# EAGLE design board (EAGLE 9.6.2)
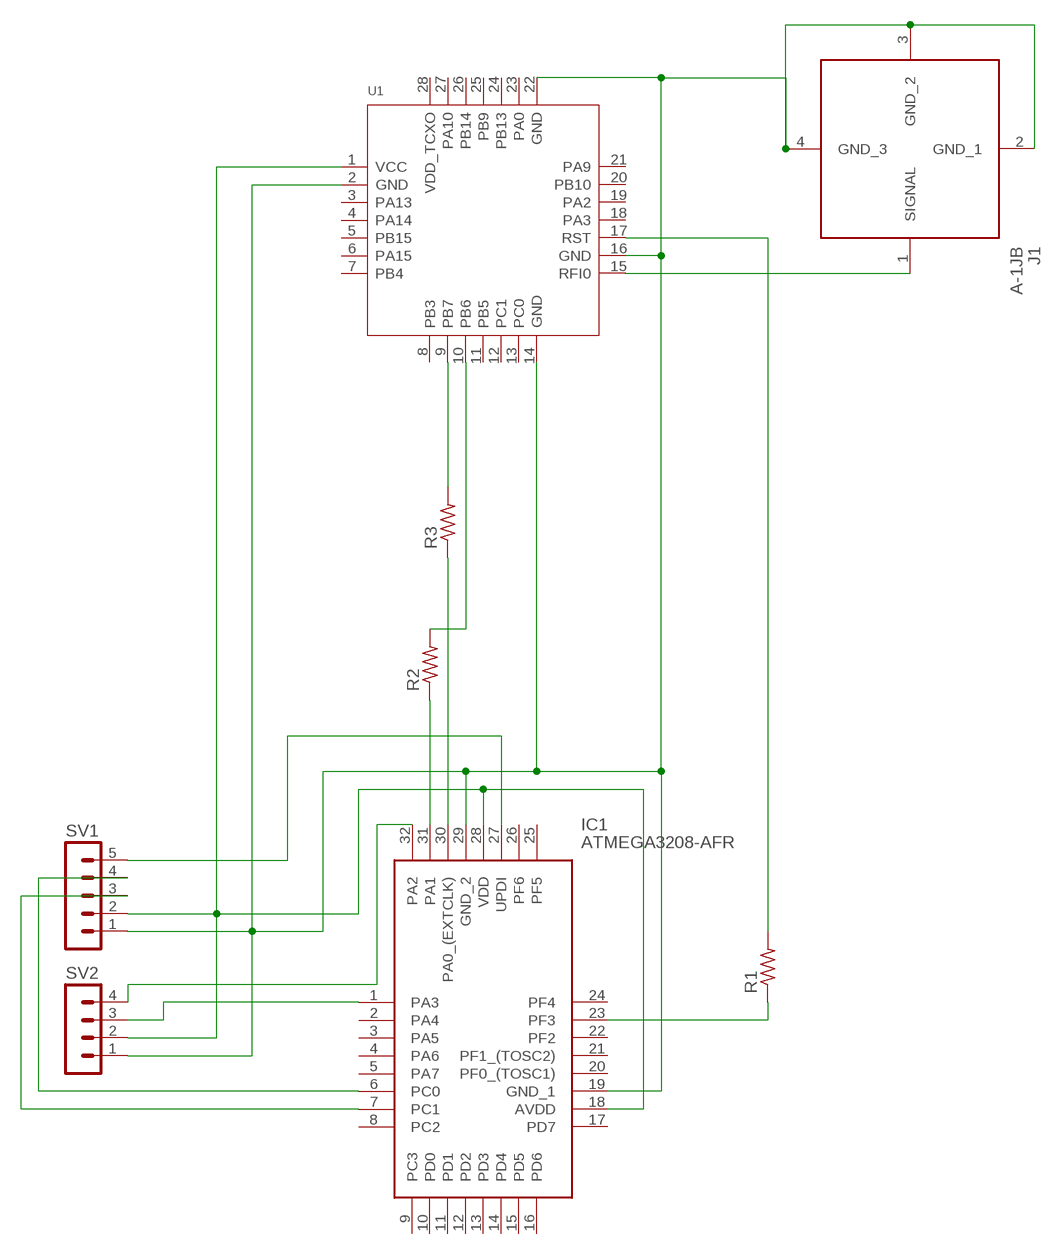
[diagram p0: schematic, sheet 1]

## Parts
IC1  ATMEGA3208-AFR  [QFP80P900X900X120-32N]
J1  A-1JB  [A1JB]
R1  22  CRCW08050000Z0EA  [RES_0805]
R2  22  CRCW08050000Z0EA  [RES_0805]
R3  22  CRCW08050000Z0EA  [RES_0805]
SV1  MA05-1  [MA05-1]
SV2  MA04-1  [MA04-1]
U1  MODULE_LORA_E5  [MODULE28P-1.25-12X12X2.5MM]

## Nets
N$1: IC1.19(GND_1) IC1.29(GND_2) J1.2(GND_1) J1.3(GND_2) J1.4(GND_3) SV1.1 SV2.1 U1.2(GND) U1.14(GND) U1.16(GND) U1.22(GND)
N$2: IC1.27(UPDI) SV1.5
N$3: IC1.18(AVDD) IC1.28(VDD) SV1.2 SV2.2 U1.1(VCC)
N$4: R1.2 U1.17(RST)
N$5: J1.1(SIGNAL) U1.15(RFI0)
N$6: R3.2 U1.9(PB7)
N$7: R2.2 U1.10(PB6)
N$8: IC1.23(PF3) R1.1
N$9: IC1.31(PA1) R2.1
N$10: IC1.30(PA0_(EXTCLK)) R3.1
N$11: IC1.32(PA2) SV2.4
N$12: IC1.1(PA3) SV2.3
N$13: IC1.6(PC0) SV1.4
N$14: IC1.7(PC1) SV1.3
Unconnected: IC1.2(PA4) IC1.3(PA5) IC1.4(PA6) IC1.5(PA7) IC1.8(PC2) IC1.9(PC3) IC1.10(PD0) IC1.11(PD1) IC1.12(PD2) IC1.13(PD3) IC1.14(PD4) IC1.15(PD5) IC1.16(PD6) IC1.17(PD7) IC1.20(PF0_(TOSC1)) IC1.21(PF1_(TOSC2)) IC1.22(PF2) IC1.24(PF4) IC1.25(PF5) IC1.26(PF6) U1.3(PA13) U1.4(PA14) U1.5(PB15) U1.6(PA15) U1.7(PB4) U1.8(PB3) U1.11(PB5) U1.12(PC1) U1.13(PC0) U1.18(PA3) U1.19(PA2) U1.20(PB10) U1.21(PA9) U1.23(PA0) U1.24(PB13) U1.25(PB9) U1.26(PB14) U1.27(PA10) U1.28(VDD_TCXO)

## Library data of the parts
IC1 = SamacSys_Parts:ATMEGA3208-AFR: 8-bit Microcontrollers - MCU 20MHz, 32KB, TQFP32, Ind 125C, Green, T&R Source: Datasheet; DESCRIPTION: 8-bit Microcontrollers - MCU 20MHz, 32KB, TQFP32, Ind 125C, Green, T&R; HEIGHT: 1.2mm; MANUFACTURER_NAME: Microchip; MANUFACTURER_PART_NUMBER: ATMEGA3208-AFR; MOUSER_PART_NUMBER: 579-ATMEGA3208AFR; MOUSER_PRICE-STOCK: https://www.mouser.co.uk/ProductDetail/Microchip-Technology-Atmel/ATMEGA3208-AFR?qs=y6ZabgHbY%252ByqMua8ssBYRQ%3D%3D
J1 = SamacSys_Parts:A-1JB: AMC Straight PCB Jack, Surface Mount Source: Datasheet <https://datasheet.datasheetarchive.com/originals/distributors/Datasheets-4/DSA-65271.pdf>; DESCRIPTION: AMC Straight PCB Jack, Surface Mount; HEIGHT: 1.05mm; MANUFACTURER_NAME: Amphenol; MANUFACTURER_PART_NUMBER: A-1JB; MOUSER_PART_NUMBER: 523-A-1JB; MOUSER_PRICE-STOCK: https://www.mouser.co.uk/ProductDetail/Amphenol-RF/A-1JB?qs=ncxkyCpAYDBidtvTkuzl1Q%3D%3D
R1-R3 = Resistor_Capacitor:CRCW08050000Z0EA: RES SMD 0 OHM JUMPER 1/8W 0805 Manufacturer's datasheet <http://www.vishay.com/docs/20035/dcrcwe3.pdf>; CREATED_BY: PCBLayout.com; DIGIKEY_PART_NUMBER: 541-0.0ATR-ND; MANUFACTURER: Vishay Dale; MPN: CRCW08050000Z0EA; PACKAGE: SMD 0805
SV1 = con-lstb:MA05-1: PIN HEADER; OC_FARNELL: unknown; OC_NEWARK: unknown
SV2 = con-lstb:MA04-1: PIN HEADER; OC_FARNELL: unknown; OC_NEWARK: unknown
U1 = LORA-E5_Eagle_Library (1):MODULE_LORA_E5

## Net classes
1 POWERLINES: width 0.254 mm

## Board
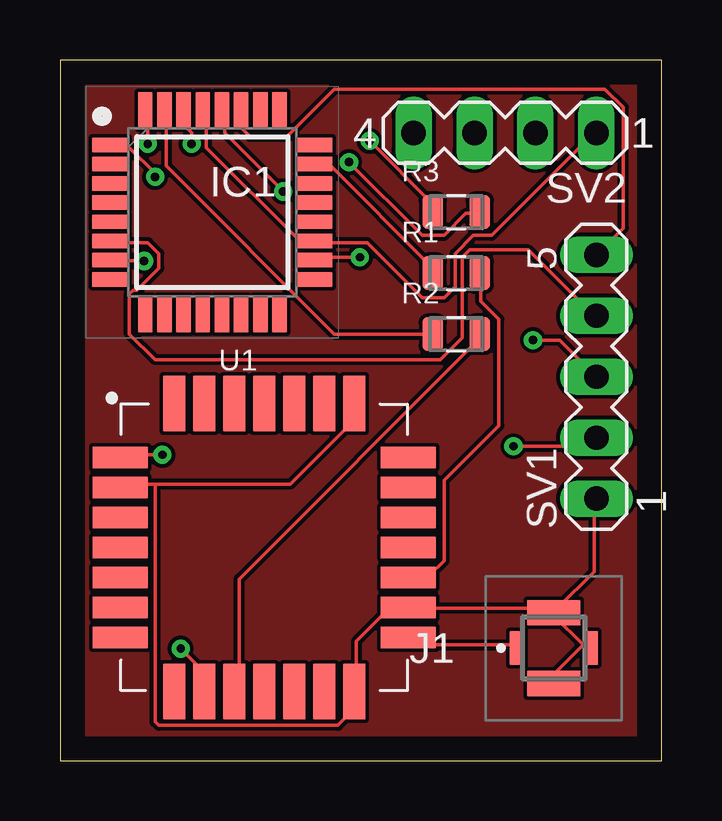
[diagram p1: board, top side]
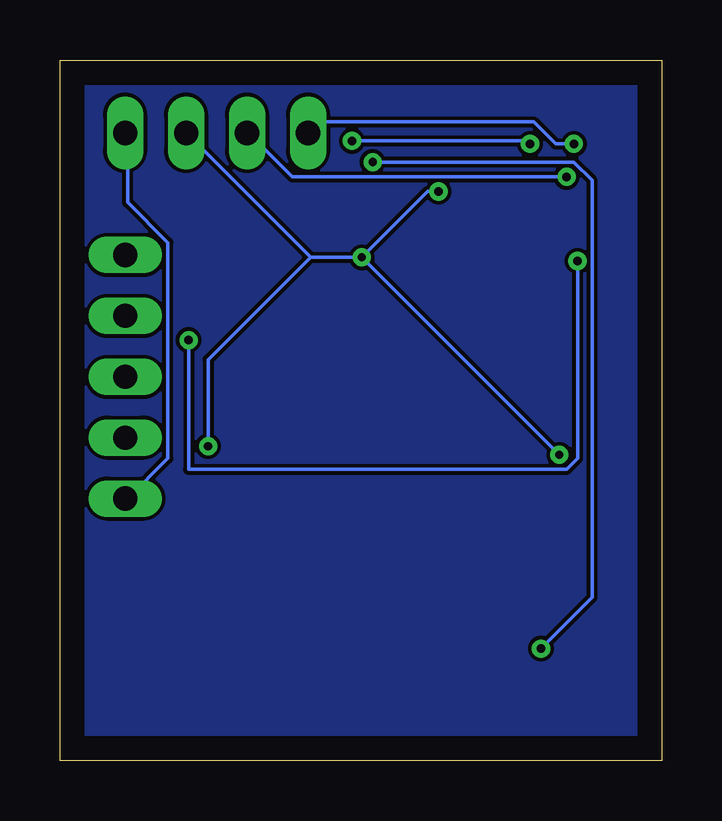
[diagram p2: board, bottom side, seen from below]

Size 25.07 x 29.2 mm. Coordinates in mm from the lower left corner, seen from the top.
Outline: 0,0 25.07,0 25.07,29.2 0,29.2 0,0
Copper layers (1*16): Top 0.035mm / dielectric 1.5mm / Bottom 0.035mm
Design rules "default": minimum track width 6mil, minimum drill 0.35mm, track to track 6mil, track to pad 6mil, pad to pad 6mil, via to via 6mil, smd to smd 6mil, copper to edge 40mil, drill to drill 6mil, minimum pad ring 10mil, minimum via ring 8mil, stop-mask expansion 4mil, vias tented up to drill 0mil, thermal gap 10mil

### Footprints (pad centres in the part's own frame; a part is rotated, then mirrored left to right if it is on the bottom)
QFP80P900X900X120-32N = smd 1.5 x 0.6: 1 -4.25,2.8; 2 -4.25,2; 3 -4.25,1.2; 4 -4.25,0.4; 5 -4.25,-0.4; 6 -4.25,-1.2; 7 -4.25,-2; 8 -4.25,-2.8; 17 4.25,-2.8; 18 4.25,-2; 19 4.25,-1.2; 20 4.25,-0.4; 21 4.25,0.4; 22 4.25,1.2; 23 4.25,2; 24 4.25,2.8 | smd 0.6 x 1.5: 9 -2.8,-4.25; 10 -2,-4.25; 11 -1.2,-4.25; 12 -0.4,-4.25; 13 0.4,-4.25; 14 1.2,-4.25; 15 2,-4.25; 16 2.8,-4.25; 25 2.8,4.25; 26 2,4.25; 27 1.2,4.25; 28 0.4,4.25; 29 -0.4,4.25; 30 -1.2,4.25; 31 -2,4.25; 32 -2.8,4.25
A1JB = smd 0.6 x 1.4: 1 1.525,0; 3 -1.525,0 | smd 2.2 x 1.05: 2 0,1.475; 4 0,-1.475
RES_0805 = smd 0.87 x 1.42: 1 -0.975,0; 2 0.975,0
MA05-1 = drill 1.016 long: 1 -5.08,0; 2 -2.54,0; 3 0,0; 4 2.54,0; 5 5.08,0
MA04-1 = drill 1.016 long: 1 -3.81,0; 2 -1.27,0; 3 1.27,0; 4 3.81,0
MODULE28P-1.25-12X12X2.5MM = smd 2.3 x 0.9: 1 -6,3.75; 2 -6,2.5; 3 -6,1.25; 4 -6,0; 5 -6,-1.25; 6 -6,-2.5; 7 -6,-3.75; 15 6,-3.75; 16 6,-2.5; 17 6,-1.25; 18 6,0; 19 6,1.25; 20 6,2.5; 21 6,3.75 | smd 0.9 x 2.3: 8 -3.75,-6; 9 -2.5,-6; 10 -1.25,-6; 11 0,-6; 12 1.25,-6; 13 2.5,-6; 14 3.75,-6; 22 3.75,6; 23 2.5,6; 24 1.25,6; 25 0,6; 26 -1.25,6; 27 -2.5,6; 28 -3.75,6

### Placement (x,y rotation side)
IC1  6.35,22.86 0 top
J1  20.57,4.7 180 top
R1  16.51,20.32 0 top
R2  16.51,17.78 0 top
R3  16.51,22.86 0 top
SV1  22.35,16 90 top
SV2  18.54,26.16 180 top
U1  8.51,8.89 0 top

### Tracks (layer width: path | path; a pad name or v marks a point on that pad's centre or on a via)
GND
  pour Top: 0,29.21 25.4,29.21 25.4,0 0,0
  pour Bottom: 0,29.21 25.4,29.21 25.4,0 0,0
N$1
  Top 0.152: 3.96,11.53 9.6,11.53 12.19,14.12 12.19,14.88 U1.22 | 3.96,11.53 2.59,11.53 U1.2 | IC1.29 6.1,27.08 6.1,25.55 9.91,21.74 10.52,21.74 IC1.19 10.67,21.59 12.8,21.59 15.09,19.3 16,19.3 16.46,19.76 16.46,21.13 17.22,21.89 17.98,21.89 22.25,26.16 SV2.1 | 21.79,4.83 22.1,4.83 J1.3 | 21.79,4.83 20.57,6.04 J1.4 | J1.2 20.57,3.61 21.79,4.83 | 20.73,6.35 20.57,6.2 J1.4 | 20.73,6.35 22.25,7.87 22.25,10.92 SV1.1 | 20.73,6.35 14.63,6.35 U1.16 14.48,6.35 13.72,6.35 12.34,4.98 12.34,3 U1.14 12.19,2.84 12.19,2.08 11.58,1.47 4.12,1.47 3.96,1.63 3.96,11.53 | 20.73,6.35 J1.4
  Bottom 0.152: SV2.1 22.25,26.16 22.25,23.27 20.57,21.59 20.57,12.6 22.25,10.92 SV1.1
N$2
  Top 0.152: SV1.5 23.47,22.2 23.47,27.23 22.71,27.99 11.43,27.99 9.45,26.01 7.92,26.01 7.62,26.31 7.62,27.08 IC1.27
N$3  (via drill 0.35)
  Top 0.152: v12.5,20.98 10.67,20.98 IC1.18 | v9.3,23.72 6.86,26.16 6.86,27.08 IC1.28 | v4.27,12.75 2.59,12.75 U1.1 | v18.9,13.11 22,13.11 SV1.2
  Bottom 0.152: 14.63,20.98 v12.5,20.98 | SV2.2 14.63,20.98 | v9.3,23.72 9.75,23.72 v12.5,20.98 | v12.5,20.98 v4.27,12.75 | v18.9,13.11 18.9,16.71 14.63,20.98
N$4
  Top 0.152: R1.2 17.53,20.22 17.53,19.15 18.29,18.39 18.29,13.97 16,11.68 16,8.33 15.39,7.72 14.63,7.72 U1.17
N$5
  Top 0.152: J1.1 18.9,4.83 14.94,4.83 14.63,5.13 U1.15
N$6  (via drill 0.35)
  Top 0.152: v12.04,24.94 15.09,21.89 16,21.89 16.92,22.81 17.37,22.81 R3.2 | v5.03,4.67 5.94,3.76 5.94,3 U1.9
  Bottom 0.152: v12.04,24.94 3.66,24.94 2.9,24.18 2.9,6.81 v5.03,4.67
N$7
  Top 0.152: R2.2 17.37,17.78 17.37,17.47 7.47,7.57 7.47,3.15 7.31,3 U1.10
N$8
  Top 0.152: R1.1 15.39,20.37 15.39,20.68 11.28,24.79 10.67,24.79 IC1.23
N$9
  Top 0.152: R2.1 11.43,17.78 4.42,24.79 4.42,27.08 IC1.31
N$10  (via drill 0.35)
  Top 0.152: R3.1 15.53,23.2 v12.9,25.83 | v5.49,25.7 5.49,26.16 5.18,26.47 5.18,27.08 IC1.30
  Bottom 0.152: v12.9,25.83 5.61,25.83 v5.49,25.7
N$11  (via drill 0.35)
  Top 0.152: v3.66,25.7 3.66,27.08 IC1.32
  Bottom 0.152: v3.66,25.7 4.42,25.7 5.33,26.62 14.17,26.62 14.63,26.16 SV2.4
N$12  (via drill 0.35)
  Top 0.152: v3.96,24.33 3.96,24.49 2.9,25.55 2.13,25.55 IC1.1
  Bottom 0.152: v3.96,24.33 15.39,24.33 17.22,26.16 SV2.3
N$13
  Top 0.152: IC1.6 2.13,21.59 3.66,21.59 4.12,21.13 4.12,20.52 3.2,19.61 3.05,19.61 2.9,19.46 2.9,17.78 3.96,16.71 15.85,16.71 16.76,17.63 16.76,20.98 17.07,21.29 19.51,21.29 22.25,18.54 SV1.4
N$14  (via drill 0.35)
  Top 0.152: v3.51,20.83 2.13,20.83 IC1.7 | SV1.3 20.83,17.53 v19.71,17.53
  Bottom 0.152: v3.51,20.83 3.51,12.6 3.96,12.14 19.71,12.14 v19.71,17.53